# Altium schematic sheet Template.SchDoc
size A4